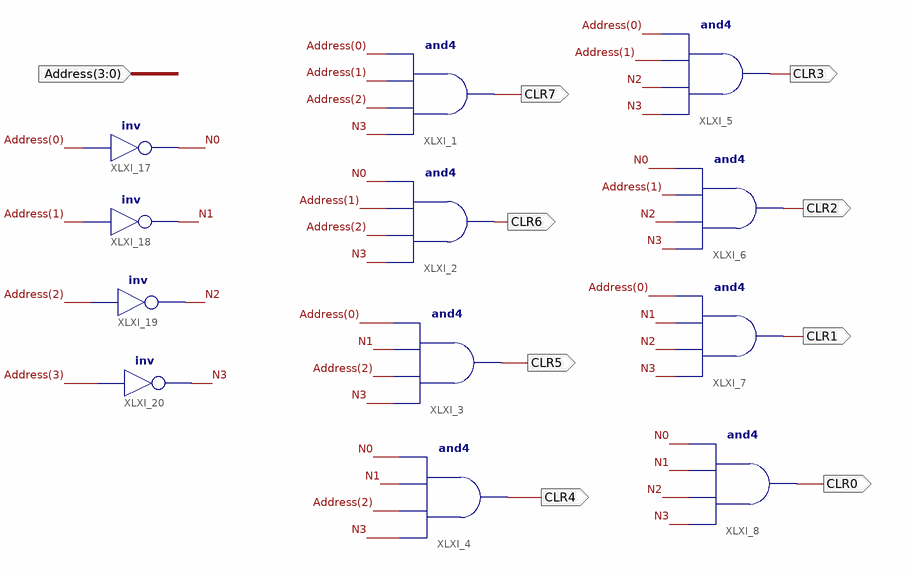
[diagram p0: schematic sheet 1]
// Xilinx ISE schematic Decoder3b8.sch (spartan3e) as structural Verilog: 12 symbols, 9 ports
module Decoder3b8 (
  input  [3:0] Address,
  output CLR7,
  output CLR6,
  output CLR4,
  output CLR5,
  output CLR3,
  output CLR2,
  output CLR1,
  output CLR0
);

  wire N0, N1, N2, N3;

  and XLXI_1 (CLR7, N3, Address[2], Address[1], Address[0]);
  and XLXI_2 (CLR6, N3, Address[2], Address[1], N0);
  and XLXI_3 (CLR5, N3, Address[2], N1, Address[0]);
  and XLXI_4 (CLR4, N3, Address[2], N1, N0);
  and XLXI_5 (CLR3, N3, N2, Address[1], Address[0]);
  and XLXI_6 (CLR2, N3, N2, Address[1], N0);
  and XLXI_7 (CLR1, N3, N2, N1, Address[0]);
  and XLXI_8 (CLR0, N3, N2, N1, N0);
  not XLXI_17 (N0, Address[0]);
  not XLXI_18 (N1, Address[1]);
  not XLXI_19 (N2, Address[2]);
  not XLXI_20 (N3, Address[3]);
endmodule
